# EAGLE design uino-motor (EAGLE 7.7.0)
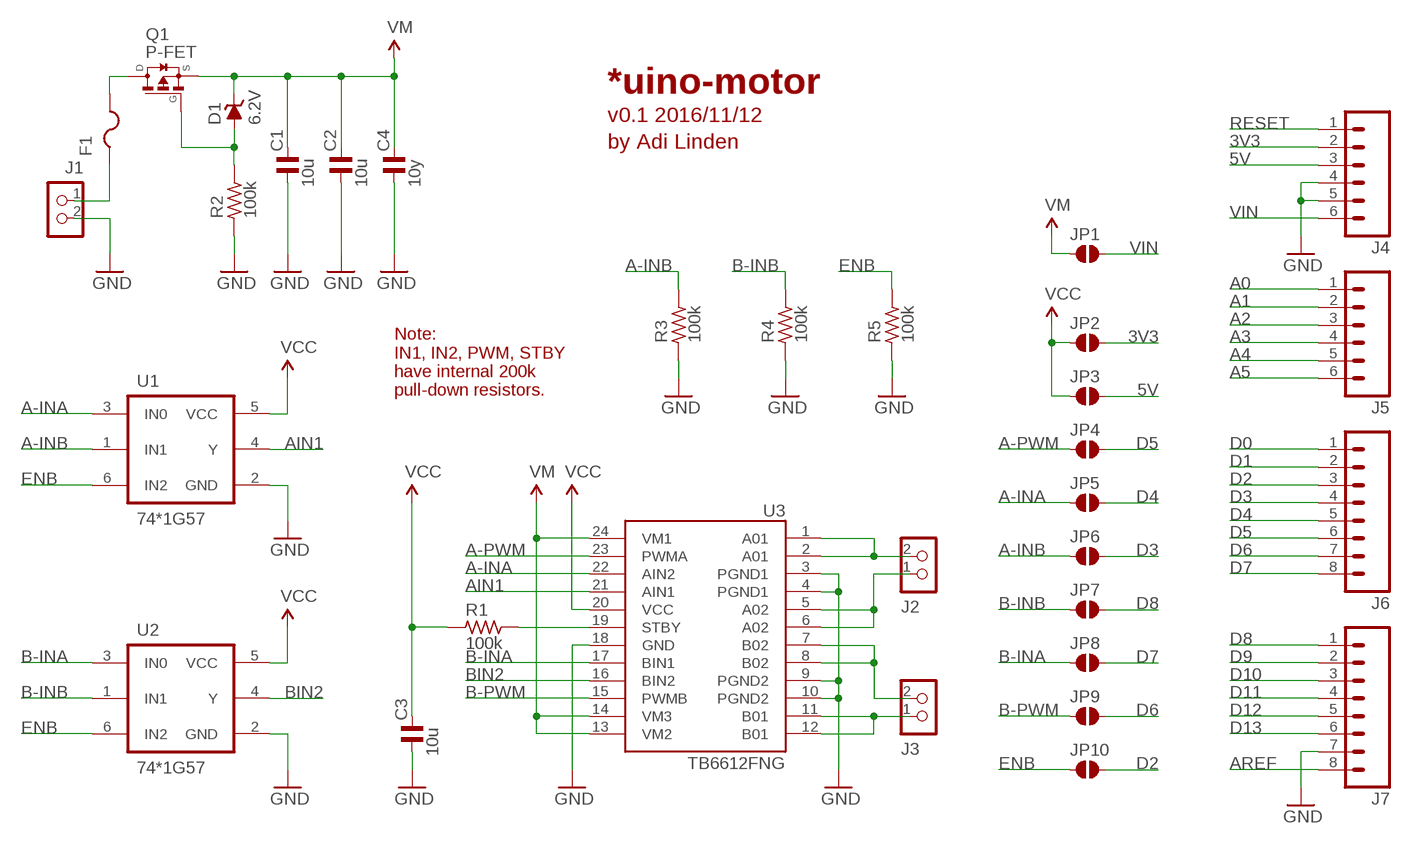
[diagram p0: schematic, sheet 1]

## Parts
C1  10u  C_0805MP  [C0805MP]
C2  10u  C_0805MP  [C0805MP]
C3  10u  C_0805MP  [C0805MP]
C4  10y  C_0805MP  [C0805MP]
D1  6.2V  BZX384  [SOD323]
F1  FUSE_PTC-TH  [PTC]
J1  CON_TERMINAL_BLOCK_02-5MM  [TERMINAL_BLOCK_2P_5]
J2  CON_TERMINAL_BLOCK_02-5MM  [TERMINAL_BLOCK_2P_5]
J3  CON_TERMINAL_BLOCK_02-5MM  [TERMINAL_BLOCK_2P_5]
J4  M06SIP  [1X06]
J5  M06SIP  [1X06]
J6  M081X08  [1X08]
J7  M081X08  [1X08]
JP1  SJ-035  [SJ-035]
JP2  SJ-035  [SJ-035]
JP3  SJ-035  [SJ-035]
JP4  SJ-035  [SJ-035]
JP5  SJ-035  [SJ-035]
JP6  SJ-035  [SJ-035]
JP7  SJ-035  [SJ-035]
JP8  SJ-035  [SJ-035]
JP9  SJ-035  [SJ-035]
JP10  SJ-035  [SJ-035]
Q1  P-FET  SI2307CDS  [SOT23]
R1  100k  R_0805MP  [R0805MP]
R2  100k  R_0805MP  [R0805MP]
R3  100k  R_0805MP  [R0805MP]
R4  100k  R_0805MP  [R0805MP]
R5  100k  R_0805MP  [R0805MP]
U1  74*1G57  SN74LVC1G97DBV  [SOT23-6]
U2  74*1G57  SN74LVC1G97DBV  [SOT23-6]
U3  TB6612FNG  [SSOP24]

## Nets
3V3: J4.2 JP2.2
5V: J4.3 JP3.2
A0: J5.1
A1: J5.2
A01: J2.2 U3.1(A01) U3.2(A01)
A2: J5.3
A02: J2.1 U3.5(A02) U3.6(A02)
A3: J5.4
A4: J5.5
A5: J5.6
A-INA: JP5.1 U1.3(IN0) U3.22(AIN2)
A-INB: JP6.1 R3.2 U1.1(IN1)
A-PWM: JP4.1 U3.23(PWMA)
AIN1: U1.4(Y) U3.21(AIN1)
AREF: J7.8
B01: J3.1 U3.11(B01) U3.12(B01)
B02: J3.2 U3.7(B02) U3.8(B02)
B-INA: JP8.1 U2.3(IN0) U3.17(BIN1)
B-INB: JP7.1 R4.2 U2.1(IN1)
B-PWM: JP9.1 U3.15(PWMB)
BIN2: U2.4(Y) U3.16(BIN2)
D0: J6.1
D1: J6.2
D2: J6.3 JP10.2
D3: J6.4 JP6.2
D4: J6.5 JP5.2
D5: J6.6 JP4.2
D6: J6.7 JP9.2
D7: J6.8 JP8.2
D8: J7.1 JP7.2
D9: J7.2
D10: J7.3
D11: J7.4
D12: J7.5
D13: J7.6
ENB: JP10.1 R5.2 U1.6(IN2) U2.6(IN2)
GND: C1.1 C2.1 C3.1 C4.1 J1.2 J4.4 J4.5 J7.7 R2.1 R3.1 R4.1 R5.1 U1.2(GND) U2.2(GND) U3.3(PGND1) U3.4(PGND1) U3.9(PGND2) U3.10(PGND2) U3.18(GND)
N$1: R1.2 U3.19(STBY)
N$5: F1.P$1 J1.1
N$6: D1.A Q1.1(G) R2.2
N$7: F1.P$2 Q1.3(D)
RESET: J4.1
VCC: C3.2 JP2.1 JP3.1 R1.1 U1.5(VCC) U2.5(VCC) U3.20(VCC)
VDD: C1.2 C2.2 C4.2 D1.C JP1.1 Q1.2(S) U3.13(VM2) U3.14(VM3) U3.24(VM1) ; supply symbol labelled VM
VIN: J4.6 JP1.2

## Notes on the sheet
- *uino-motor
- v0.1 2016/11/12
- by Adi Linden
- Note:
  IN1, IN2, PWM, STBY
  have internal 200k
  pull-down resistors.

## Library data of the parts
C1-C4 = rc-master-smd:C_: NON-POLARIZED CAP
D1 = diode:BZX384*: ZENER DIODE BZX384
F1 = adi-misc:FUSE_PTC: PTC fuses, resettable thermistors
J1-J3 = adi-misc:CON_TERMINAL_BLOCK_02: 2 poles wire to board terminal block
J4 J5 = SparkFun:M06: Header 6 Standard 6-pin 0.1" header. Use with straight break away headers (SKU : PRT-00116), right angle break away headers (PRT-00553), swiss pins (PRT-00743), machine pins (PRT-00117), and female headers (PRT-00115). Molex polarized connector foot print use with SKU : PRT-08094 with associated crimp pins and housings. NOTES ON THE VARIANTS LOCK and LOCK_LONGPADS... This footprint was designed to help hold the alignment of a through-hole component (i.e. 6-pin header) while soldering it into place. You may notice that each hole has been shifted either up or down by 0.005 of an inch from it's more standard position (which is a perfectly straight line). This slight alteration caused the pins (the squares in the middle) to touch the edges of the holes. Because they are alternating, it causes a "brace" to hold the component in place. 0.005 has proven to be the perfect amount of "off-center" position when using our standard breakaway headers. Although looks a little odd when you look at the bare footprint, once you have a header in there, the alteration is very hard to notice. Also, if you push a header all the way into place, it is covered up entirely on the bottom side. This idea of altering the position of holes to aid alignment will be further integrated into the Sparkfun Library for other footprints. It can help hold any component with 3 or more connection pins.
J6 J7 = SparkFun:M08: Header 8 Standard 8-pin 0.1" header. Use with straight break away headers (SKU : PRT-00116), right angle break away headers (PRT-00553), swiss pins (PRT-00743), machine pins (PRT-00117), and female headers (PRT-00115).
JP1-JP10 = jumpers:SJ-: Solder Jumper
Q1 = transistor-fet:SI2307CDS: P-Channel MOSFET
R1-R5 = rc-master-smd:R_: RESISTOR
U1 U2 = 74LV:SN74LVC1G97: Configurable Multiple-Function Gate
U3 = SparkFun-PowerIC:TB6612FNG: Toshiba 1A dual motor driver IC-09363; PROD_ID: IC-09363

## Board
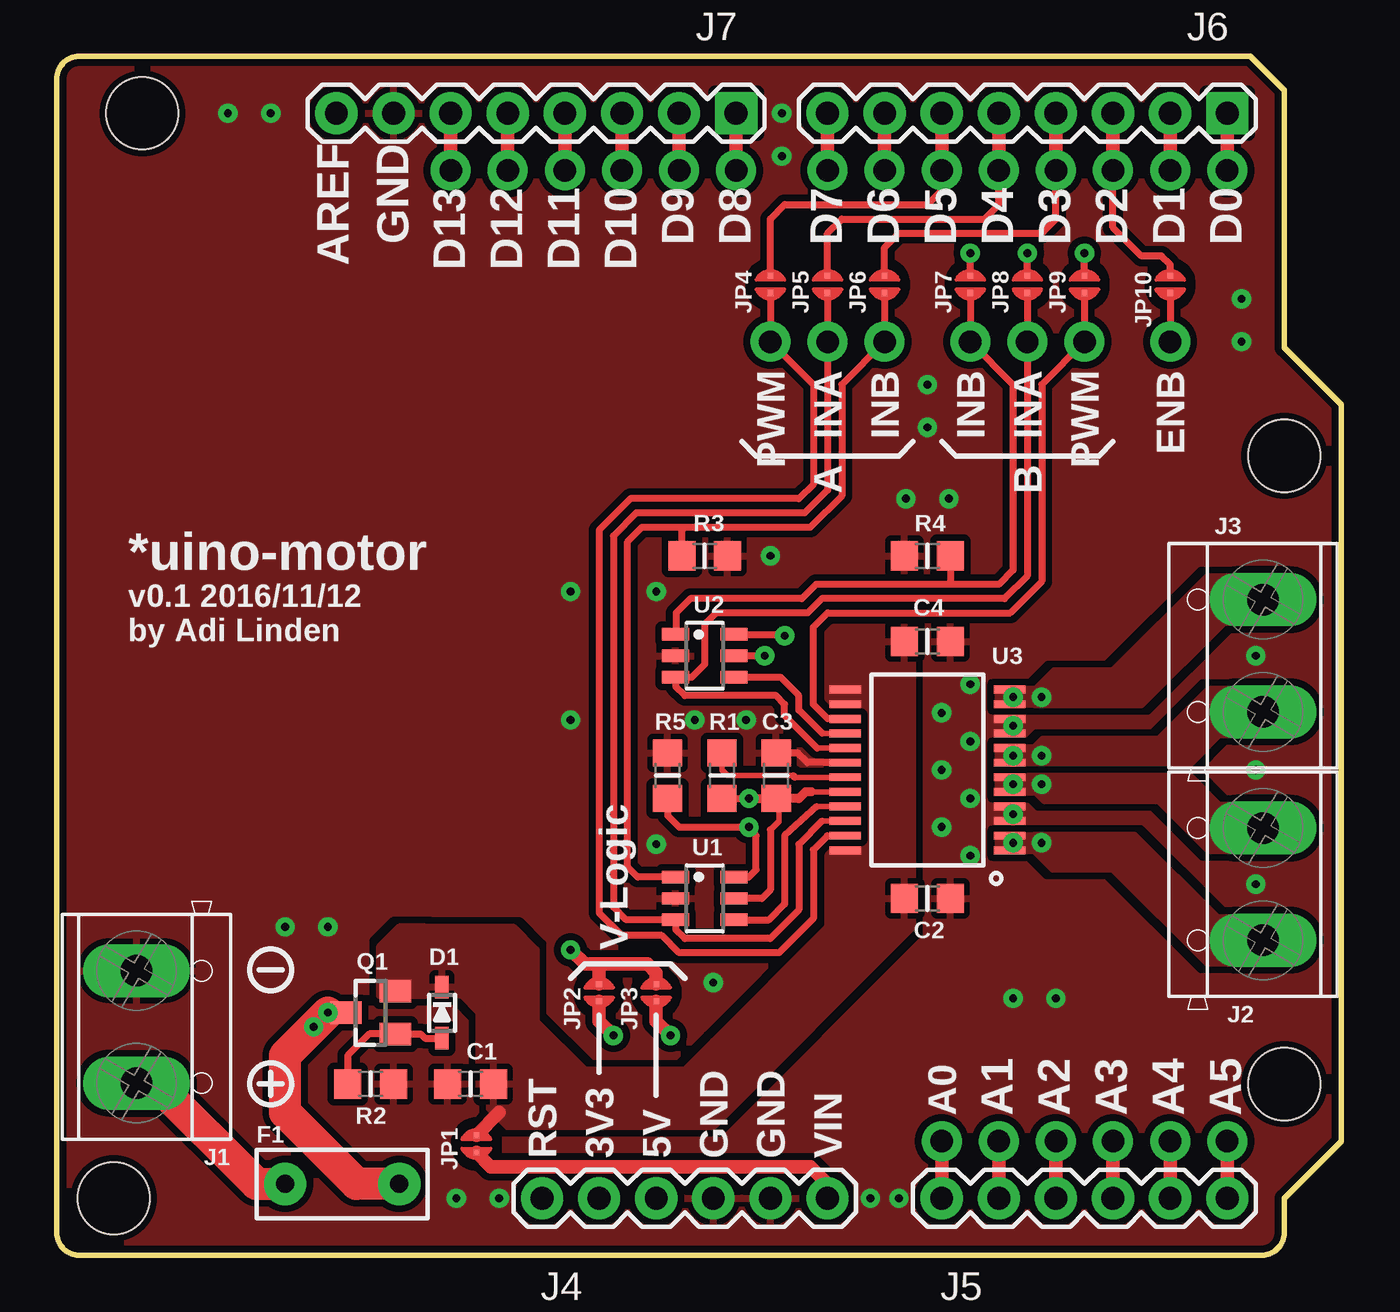
[diagram p1: board, top side]
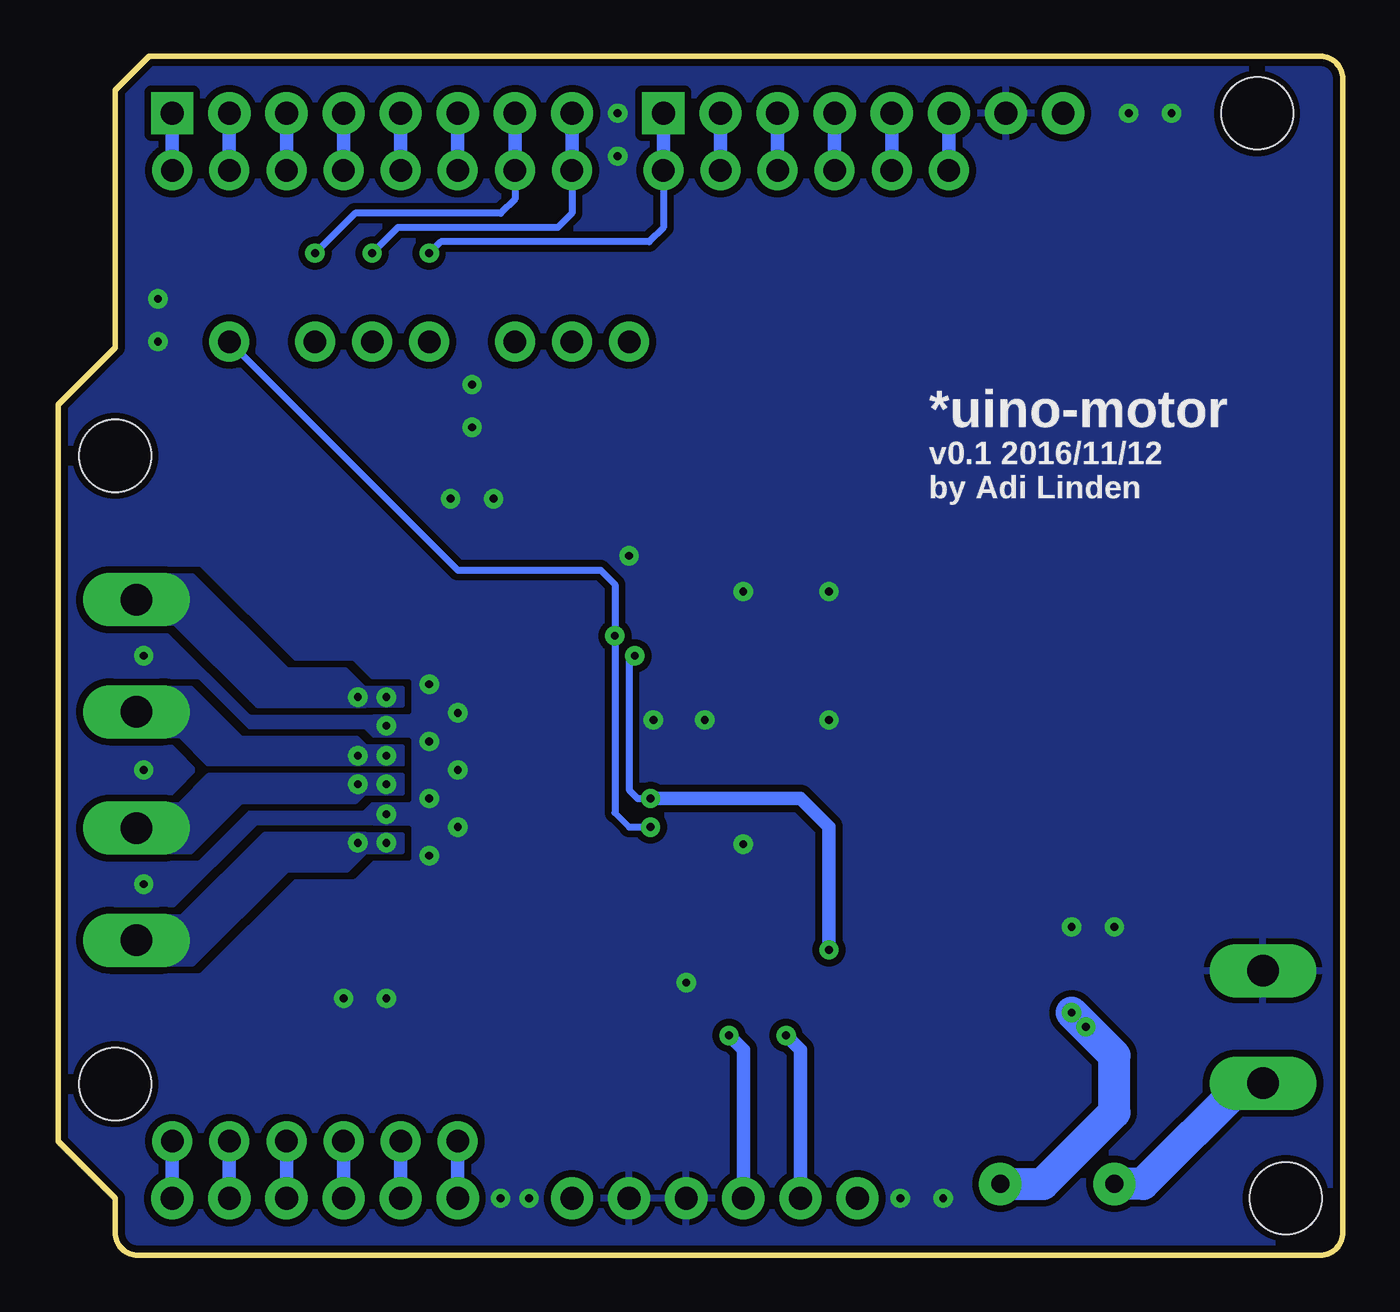
[diagram p2: board, bottom side, seen from below]

Size 57.15 x 53.34 mm. Coordinates in mm from the lower left corner, seen from the top.
Outline: 53.09,53.34 54.61,51.82 54.61,40.39 57.15,37.85 57.15,5.08 54.61,2.54 54.61,1 arc-90 53.61,0 1,0 arc-90 0,1 0,52.34 arc-90 1,53.34 53.09,53.34
Copper layers (1*16): Top 0.035mm / dielectric 1.5mm / Bottom 0.035mm
Design rules "SeeedStudio_2layer_DRU_no_angle_20140221 *": minimum track width 6mil, minimum drill 12mil, track to track 6mil, track to pad 6mil, pad to pad 6mil, via to via 6mil, smd to smd 0mil, copper to edge 10mil, drill to drill 10mil, minimum pad ring 10mil, minimum via ring 10mil, stop-mask expansion 2mil, vias tented up to drill 25mil, thermal gap 10mil
Holes 3.2 mm at 54.61,35.56 54.61,7.62 3.81,50.8 2.54,2.54

### Footprints (pad centres in the part's own frame; a part is rotated, then mirrored left to right if it is on the bottom)
C0805MP = smd 1.2 x 1.3: 1 -1.016,0; 2 1.016,0
SOD323 = smd 1 x 0.6: A 1.143,0; C -1.143,0
PTC = drill 0.8 pad 1.88: P$1 -2.54,0; P$2 2.54,0
TERMINAL_BLOCK_2P_5 = drill 1.4 pad 2.38 long: 1 2.5,-0.45; 2 -2.5,-0.45
1X06 = drill 1.016 pad 1.88: 1 0,0; 2 2.54,0; 3 5.08,0; 4 7.62,0; 5 10.16,0; 6 12.7,0
1X08 = drill 1.016 pad 1.88 square: 1 0,0 | drill 1.016 pad 1.88: 2 2.54,0; 3 5.08,0; 4 7.62,0; 5 10.16,0; 6 12.7,0; 7 15.24,0; 8 17.78,0
SJ-035 = smd 0.254 x 0.254: 1 -0.381,0; 2 0.381,0
SOT23 = smd 1 x 1.4: 1 -0.95,-1.1; 2 0.95,-1.1; 3 0,1.1
R0805MP = smd 1.2 x 1.3: 1 -1.016,0; 2 1.016,0
SOT23-6 = smd 0.55 x 1.2: 1 -0.95,-1.3; 2 0,-1.3; 3 0.95,-1.3; 4 0.95,1.3; 5 0,1.3; 6 -0.95,1.3
SSOP24 = smd 0.348 x 1.397: 1 -3.575,-3.656; 2 -2.925,-3.656; 3 -2.275,-3.656; 4 -1.625,-3.656; 5 -0.975,-3.656; 6 -0.325,-3.656; 7 0.325,-3.656; 8 0.975,-3.656; 9 1.625,-3.656; 10 2.275,-3.656; 11 2.925,-3.656; 12 3.575,-3.656; 13 3.575,3.656; 14 2.925,3.656; 15 2.275,3.656; 16 1.625,3.656; 17 0.975,3.656; 18 0.325,3.656; 19 -0.325,3.656; 20 -0.975,3.656; 21 -1.625,3.656; 22 -2.275,3.656; 23 -2.925,3.656; 24 -3.575,3.656

### Placement (x,y rotation side)
C1  18.41,7.62 0 top
C2  38.73,15.88 180 top
C3  32,21.34 270 top
C4  38.73,27.3 180 top
D1  17.14,10.79 270 top
F1  12.7,3.17 0 top
J1  4,10.16 270 top
J2  53.21,16.51 90 top
J3  53.21,26.67 90 top
J4  21.59,2.54 0 top
J5  39.37,2.54 0 top
J6  52.07,50.8 180 top
J7  30.23,50.8 180 top
JP1  18.67,4.95 270 top
JP2  24.13,11.68 270 top
JP3  26.67,11.68 270 top
JP4  31.75,43.18 90 top
JP5  34.29,43.18 90 top
JP6  36.83,43.18 90 top
JP7  40.64,43.18 90 top
JP8  43.18,43.18 90 top
JP9  45.72,43.18 90 top
JP10  49.53,43.18 90 top
Q1  13.97,10.79 90 top
R1  29.59,21.34 90 top
R2  13.97,7.62 180 top
R3  28.83,31.11 180 top
R4  38.73,31.11 0 top
R5  27.18,21.34 270 top
U1  28.83,15.88 270 top
U2  28.83,26.67 270 top
U3  38.73,21.59 90 top

### Tracks (layer width: path | path; a pad name or v marks a point on that pad's centre or on a via)
3V3  (via drill 0.35)
  Top 0.61: JP2.2 24.13,10.41 v24.77,9.78
  Bottom 0.61: v24.77,9.78 24.13,9.14 J4.2
5V  (via drill 0.35)
  Top 0.61: JP3.2 26.67,10.41 v27.3,9.78
  Bottom 0.61: v27.3,9.78 26.67,9.14 J4.3
A0  (via drill 1 pad 1.78)
  Top 0.61: v39.37,5.08 J5.1
  Bottom 0.61: v39.37,5.08 J5.1
A1  (via drill 1 pad 1.78)
  Top 0.61: v41.91,5.08 J5.2
  Bottom 0.61: v41.91,5.08 J5.2
A01  (via drill 0.35)
  other vias: 42.55,18.35 43.81,18.35
  pour Top (isolate 0.305, no thermals): 41.85,18.7 44.45,18.7 44.45,17.97 41.85,17.97
  pour Top (isolate 0.305, no thermals): 43.5,18.73 43.5,17.97 44.32,17.14 46.99,17.14 51.18,12.95 54.86,12.95 55.24,13.34 55.24,14.61 54.8,15.05 51.63,15.05 47.94,18.73
  pour Bottom (isolate 0.305, no thermals): 43.5,18.73 43.5,17.97 44.32,17.14 46.99,17.14 51.18,12.95 54.86,12.95 55.24,13.34 55.24,14.61 54.8,15.05 51.63,15.05 47.94,18.73
  pour Bottom (isolate 0.305, no thermals): 41.85,18.7 44.45,18.7 44.45,17.97 41.85,17.97
A2  (via drill 1 pad 1.78)
  Top 0.61: v44.45,5.08 J5.3
  Bottom 0.61: v44.45,5.08 J5.3
A02  (via drill 0.35)
  other vias: 43.81,20.95 42.55,20.95
  pour Top (isolate 0.305, no thermals): 41.85,21.34 44.45,21.34 44.45,20.57 41.85,20.57
  pour Top (isolate 0.305, no thermals): 43.5,21.34 50.42,21.34 51.69,20.07 54.86,20.07 55.24,19.68 55.24,18.41 54.8,17.97 51.24,17.97 49.02,20.19 43.94,20.19 43.5,20.64
  pour Bottom (isolate 0.305, no thermals): 43.5,21.34 50.42,21.34 51.69,20.07 54.86,20 55.24,19.68 55.24,18.41 54.8,17.97 51.24,17.97 49.02,20.19 43.94,20.19 43.5,20.64
  pour Bottom (isolate 0.305, no thermals): 41.85,21.34 44.45,21.34 44.45,20.57 41.85,20.57
A3  (via drill 1 pad 1.78)
  Top 0.61: v46.99,5.08 J5.4
  Bottom 0.61: v46.99,5.08 J5.4
A4  (via drill 1 pad 1.78)
  Top 0.61: v49.53,5.08 J5.5
  Bottom 0.61: v49.53,5.08 J5.5
A5  (via drill 1 pad 1.78)
  Top 0.61: v52.07,5.08 J5.6
  Bottom 0.61: v52.07,5.08 J5.6
A-INA  (via drill 1 pad 1.78)
  Top 0.254: U3.22 34.05,19.32
  Top 0.305: 34.05,19.32 33.02,18.29 33.02,15.37 31.75,14.1 27.94,14.1 27.53,14.51 U1.3 25.33,14.93 24.77,15.49 24.77,32 25.78,33.02 33.27,33.02 34.29,34.04 v34.29,40.64 JP5.1
A-INB  (via drill 1 pad 1.78)
  Top 0.305: U1.1 25.85,16.82 25.4,17.27 25.4,31.75 26.04,32.38 27.94,32.38 | 27.94,32.38 33.53,32.38 34.92,33.78 34.92,38.73 v36.83,40.64 JP6.1 | R3.2 27.81,32.26 27.94,32.38
A-PWM  (via drill 1 pad 1.78)
  Top 0.254: U3.23 34.29,18.66
  Top 0.305: 34.29,18.66 33.66,18.03 33.66,14.99 32.13,13.46 27.69,13.46 26.92,14.22 25.15,14.22 24.13,15.24 24.13,32.26 25.53,33.66 33.02,33.66 33.66,34.29 33.66,38.73 v31.75,40.64 JP4.1
AIN1
  Top 0.254: U3.21 33.81,19.96
  Top 0.305: 33.81,19.96 32.38,18.67 32.38,15.62 31.69,14.93 U1.4
B01  (via drill 0.35)
  other vias: 42.55,24.83 43.81,24.83
  pour Top (isolate 0.305, no thermals): 41.85,25.21 44.45,25.21 44.45,24.48 41.85,24.48
  pour Top (isolate 0.305, no thermals): 43.5,24.45 48.26,24.45 51.94,28.13 54.8,28.13 55.24,28.57 55.24,29.84 54.86,30.23 51.18,30.23 46.99,26.04 44.39,26.04 43.5,25.15
  pour Bottom (isolate 0.305, no thermals): 43.5,24.45 48.26,24.45 51.94,28.13 54.8,28.13 55.24,28.57 55.24,29.84 54.86,30.23 51.18,30.23 46.99,26.04 44.39,26.04 43.5,25.15
  pour Bottom (isolate 0.305, no thermals): 41.85,25.21 44.45,25.21 44.45,24.48 41.85,24.48
B02  (via drill 0.35)
  other vias: 43.81,22.23 42.55,22.23
  pour Top (isolate 0.305, rank 2, no thermals): 41.85,22.61 44.45,22.61 44.45,21.84 41.85,21.84
  pour Top (isolate 0.305, rank 2, no thermals): 43.5,21.84 50.42,21.84 51.69,23.11 54.86,23.11 55.24,23.5 55.24,24.77 54.8,25.21 51.24,25.21 49.02,22.99 43.88,22.99 43.5,22.61
  pour Bottom (isolate 0.305, rank 2, no thermals): 43.5,21.84 50.42,21.84 51.69,23.11 54.86,23.11 55.24,23.5 55.24,24.77 54.8,25.21 51.24,25.21 49.02,22.99 43.88,22.99 43.5,22.61
  pour Bottom (isolate 0.305, rank 2, no thermals): 41.85,22.61 44.45,22.61 44.45,21.84 41.85,21.84
B-INA  (via drill 1 pad 1.78)
  Top 0.254: U3.17 33.82,22.57
  Top 0.305: 33.82,22.57 32.38,24 32.38,24.51 32,24.89 27.94,24.89 27.53,25.3 U2.3 28.26,25.72 28.83,26.29 28.83,28.07 29.34,28.57 33.4,28.57 34.04,29.21 42.16,29.21 43.18,30.23 v43.18,40.64 JP8.1
B-INB  (via drill 1 pad 1.78)
  Top 0.254: 27.56,27.65 U2.1
  Top 0.305: 27.56,27.65 27.56,28.57 28.19,29.21 33.15,29.21 33.78,29.84 39.81,29.84 | 39.81,29.84 41.91,29.84 42.55,30.48 42.55,38.73 v40.64,40.64 JP7.1 | R4.2 39.75,29.91 39.81,29.84
B-PWM  (via drill 1 pad 1.78)
  Top 0.254: U3.15 34.3,23.86
  Top 0.305: 34.3,23.86 33.66,24.51 33.66,27.94 34.29,28.57 42.42,28.57 43.81,29.97 43.81,38.73 v45.72,40.64 JP9.1
BIN2
  Top 0.254: U3.16 34.06,23.21
  Top 0.305: 34.06,23.21 33.02,24.26 33.02,24.89 32.19,25.72 U2.4
D0  (via drill 1 pad 1.78)
  Top 0.61: J6.1 v52.07,48.26
  Bottom 0.61: J6.1 v52.07,48.26
D1  (via drill 1 pad 1.78)
  Top 0.61: J6.2 v49.53,48.26
  Bottom 0.61: J6.2 v49.53,48.26
D2  (via drill 1 pad 1.78)
  Top 0.305: JP10.2 49.53,44.07 49.15,44.45 48.26,44.45 46.99,45.72 v46.99,48.26
  Top 0.61: J6.3 v46.99,48.26
  Bottom 0.61: J6.3 v46.99,48.26
D3  (via drill 1 pad 1.78)
  Top 0.305: JP6.2 36.83,44.83 37.47,45.47 43.81,45.47 44.45,46.1 v44.45,48.26
  Top 0.61: J6.4 v44.45,48.26
  Bottom 0.61: J6.4 v44.45,48.26
D4  (via drill 1 pad 1.78)
  Top 0.305: JP5.2 34.29,45.47 34.92,46.1 41.27,46.1 41.91,46.74 v41.91,48.26
  Top 0.61: J6.5 v41.91,48.26
  Bottom 0.61: J6.5 v41.91,48.26
D5  (via drill 1 pad 1.78)
  Top 0.305: JP4.2 31.75,46.1 32.38,46.74 38.73,46.74 39.37,47.37 v39.37,48.26
  Top 0.61: J6.6 v39.37,48.26
  Bottom 0.61: J6.6 v39.37,48.26
D6  (via drill 0.35, 1 pad 1.78)
  Top 0.305: JP9.2 v45.72,44.58
  Top 0.61: J6.7 v36.83,48.26
  Bottom 0.305: v45.72,44.58 43.94,46.35 37.47,46.35 36.83,46.99 v36.83,48.26
  Bottom 0.61: J6.7 v36.83,48.26
D7  (via drill 0.35, 1 pad 1.78)
  Top 0.305: JP8.2 v43.18,44.58
  Top 0.61: J6.8 v34.29,48.26
  Bottom 0.305: v43.18,44.58 42.04,45.72 34.92,45.72 34.29,46.35 v34.29,48.26
  Bottom 0.61: J6.8 v34.29,48.26
D8  (via drill 0.35, 1 pad 1.78)
  Top 0.305: JP7.2 v40.64,44.58
  Top 0.61: J7.1 v30.23,48.26
  Bottom 0.305: v40.64,44.58 40.13,45.09 30.86,45.09 30.23,45.72 v30.23,48.26
  Bottom 0.61: J7.1 v30.23,48.26
D9  (via drill 1 pad 1.78)
  Top 0.61: J7.2 v27.69,48.26
  Bottom 0.61: J7.2 v27.69,48.26
D10  (via drill 1 pad 1.78)
  Top 0.61: J7.3 v25.15,48.26
  Bottom 0.61: J7.3 v25.15,48.26
D11  (via drill 1 pad 1.78)
  Top 0.61: J7.4 v22.61,48.26
  Bottom 0.61: J7.4 v22.61,48.26
D12  (via drill 1 pad 1.78)
  Top 0.61: J7.5 v20.07,48.26
  Bottom 0.61: J7.5 v20.07,48.26
D13  (via drill 1 pad 1.78)
  Top 0.61: J7.6 v17.53,48.26
  Bottom 0.61: J7.6 v17.53,48.26
ENB  (via drill 0.35, 1 pad 1.78)
  Top 0.254: 32.32,27.62 v32.38,27.56 | v30.8,19.05 30.8,18.99
  Top 0.305: U1.6 30.8,16.82 31.11,17.14 31.11,18.67 30.8,18.99 | U2.6 32.32,27.62 | R5.2 27.18,19.56 27.69,19.05 v30.8,19.05 | JP10.1 v49.53,40.64
  Bottom 0.254: 32.38,19.68 31.75,19.05
  Bottom 0.305: 32.38,19.68 v32.38,27.56 32.38,29.84 33.02,30.48 39.37,30.48 v49.53,40.64 | 31.75,19.05 v30.8,19.05
GND  (via drill 0.35)
  Top 0.305: U3.18 33.39,21.91 32.96,22.35 C3.1
  other vias: 53.34,26.67 53.34,21.59 53.34,16.51 38.73,38.73 38.73,36.83 37.78,33.66 39.69,33.66 39.37,19.05 40.64,20.32 39.37,21.59 39.37,24.13 40.64,22.86 40.64,25.4 40.64,17.78 42.55,23.56 42.55,19.62 52.7,42.55 52.7,40.64 10.16,14.61 12.06,14.61 17.78,2.54 19.68,2.54 36.2,2.54 37.47,2.54 42.55,11.43 44.45,11.43 32.26,50.8 9.53,50.8 7.62,50.8 32.26,48.9 31.75,31.11 26.67,29.53 28.38,23.81 26.67,18.29 30.67,23.81 29.21,12.13 22.86,29.53 22.86,23.81
  pour Top (isolate 0.305, rank 5): 0,0 57.15,0 57.15,53.34 0,53.34
  pour Bottom (isolate 0.305, rank 5): 0,0 57.15,0 57.15,53.34 0,53.34
  pour Top (isolate 0.305, rank 5, no thermals): 40.64,22.86 45.09,22.86 45.09,24.13 40.64,24.13
  pour Top (isolate 0.305, rank 5, no thermals): 40.64,19.05 45.09,19.05 45.09,20.32 40.64,20.32
N$1
  Top 0.254: U3.19 32.84,21.27 | 32.77,21.34 29.84,21.34 29.59,21.59 R1.2
  Top 0.305: 32.84,21.27 32.77,21.34
N$5
  Top 1.422: J1.1 4.41,7.66 8.89,3.17 F1.P$1
  Bottom 1.422: J1.1 4.41,7.66 8.89,3.17 F1.P$1
N$6
  Top 0.305: R2.2 12.95,8.89 13.91,9.85 Q1.1 16.19,9.85 16.38,9.65 D1.A
N$7  (via drill 0.35)
  Top 0.406: v12.06,10.79 Q1.3
  Top 1.422: F1.P$2 13.34,3.17 10.16,6.35 10.16,8.89 v11.43,10.16 v12.06,10.79
  Bottom 1.422: F1.P$2 13.34,3.17 10.16,6.35 10.16,8.89 v11.43,10.16 v12.06,10.79
VCC  (via drill 0.35)
  Top 0.254: U3.20 33.57,20.61 | 31.75,18.92 32.13,19.3 32.13,20.19 C3.2
  Top 0.305: 31.75,18.92 31.75,16.26 31.37,15.88 U1.5 | v31.5,26.67 U2.5 | R1.1 v30.8,20.32
  Top 0.406: 33.57,20.61 33.31,20.61 33.02,20.32 C3.2 v30.8,20.32
  Top 0.61: JP3.1 26.67,12.57 26.29,12.95 24.13,12.95 | JP2.1 24.13,12.95 | 24.13,12.95 23.5,12.95 v22.86,13.59
  Bottom 0.305: v31.5,26.67 31.75,26.42 31.75,20.7 31.37,20.32 v30.8,20.32
  Bottom 0.61: v30.8,20.32 24.13,20.32 22.86,19.05 v22.86,13.59
VDD
  Top 0.61: JP1.1 19.68,6.35
  pour Top (isolate 0.305): 34.54,27.94 34.29,27.69 34.29,26.04 38.1,26.04 38.1,27.94
  pour Top (isolate 0.305): 34.29,17.14 34.29,14.61 29.21,9.53 29.21,5.71 38.1,14.61 38.1,17.14
  pour Top (isolate 0.305): 29.21,5.71 20.07,5.71 18.8,6.99 18.8,10.79 18.03,11.56 16.26,11.56 16.26,14.61 20.32,14.61 21.34,13.59 21.34,10.41 23.5,8.26 27.94,8.26 29.21,9.53
  pour Top (isolate 0.305, no thermals): 15.24,14.61 14.35,13.72 14.35,11.56 16.38,11.56 16.38,14.61
  pour Top (isolate 0.305, no thermals): 34.29,26.04 34.29,24.77 35.24,23.81 35.24,18.73 34.29,17.78 34.29,17.14 38.1,17.14 38.1,26.04
VIN
  Top 0.61: JP1.2 19.3,3.94 33.53,3.94 34.29,3.17 J4.6

### Text on the board
tPlace: AREF | GND | D13 | D12 | D11 | D10 | D9 | D8 | D7 | D6 | D5 | D4 | D3 | D2 | D1 | D0 | PWM | INA | INB | INB | INA | PWM | ENB | A | B | *uino-motor | v0.1 2016/11/12 | by Adi Linden | V-Logic | A0 | A1 | A2 | A3 | A4 | A5 | RST | 3V3 | 5V | GND | GND | VIN
bPlace: *uino-motor | v0.1 2016/11/12 | by Adi Linden